# Altium schematic sheet ej_2.SchDoc
size A4
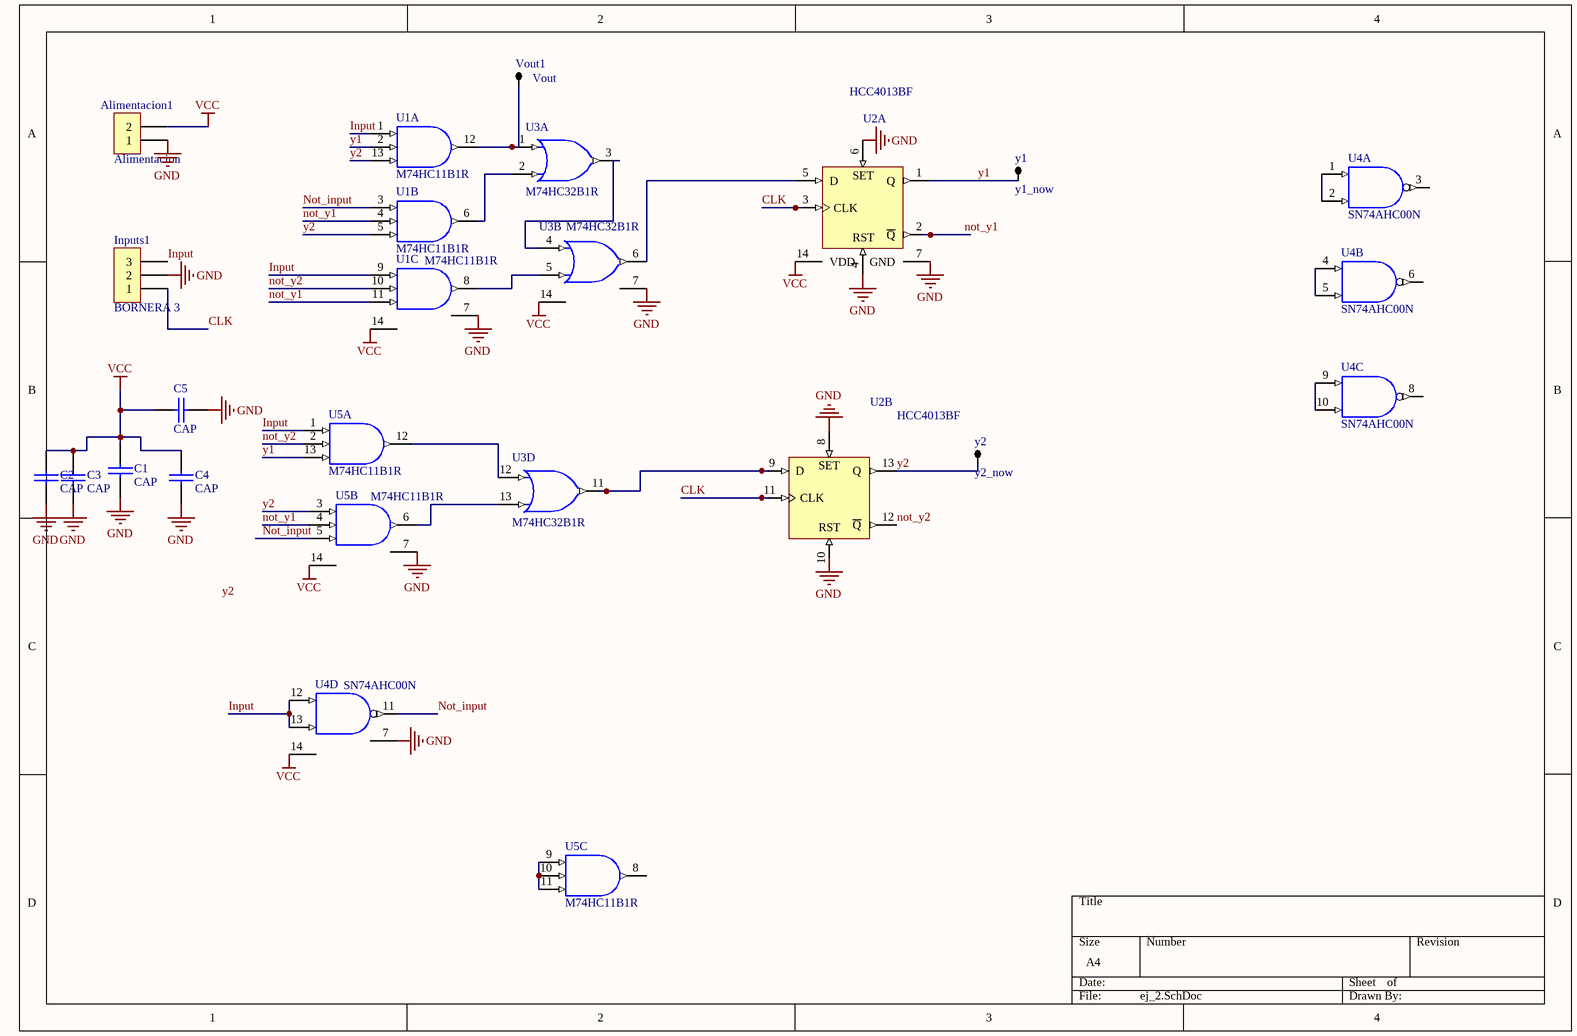
[diagram p0: ej_2.SchDoc]

## Parts
Alimentacion1  Alimentacion  [BORNERA2]
C1  CAP  [CAP200]
C2  CAP  [CAP200]
C3  CAP  [CAP200]
C4  CAP  [CAP200]
C5  CAP  [CAP200]
Inputs1  BORNERA 3  [BORNERA3]
U1  M74HC11B1R  [DIP14]  (parts A,B,C of 3)
U2  HCC4013BF  [CDIP14]  (parts A,B of 2)
U3  M74HC32B1R  [DIP14]  (parts A,B,D of 4)
U4  SN74AHC00N  [N014]  (parts A,B,C,D of 4)
U5  M74HC11B1R  [DIP14]  (parts A,B,C of 3)
Vout1  Vout  [TPTH]
y1  y1_now  [TPTH]
y2  y2_now  [TPTH]

## Nets
GND: Alimentacion1.1 C1.2 C2.2 C3.2 C4.2 C5.2 Inputs1.2 U1.7(GND) U2.4(RST) U2.6(S) U2.7(GND) U2.8(S) U3.7(GND) U4.7(GND) U5.7(GND)
VCC: Alimentacion1.2 C1.1 C2.1 C3.1 C4.1 C5.1 U1.14(VCC) U2.14(VDD) U3.14(VCC) U4.14(VCC) U5.14(VCC)  [also labelled VDD]
CLK: Inputs1.1 U2.3(CLK) U2.11(CLK)
Input: Inputs1.3 U1.1(A) U1.9(A) U4.12(A) U4.13(B) U5.1(A)
Not_input: U1.3(A) U4.11(Y) U5.5(C)
not_y1: U1.4(B) U1.11(C) U2.2(~{Q}) U5.4(B)
not_y2: U1.10(B) U2.12(~{Q}) U5.2(B)
y1: U1.2(B) U2.1(Q) U5.13(C) y1.1
y2: U1.5(C) U1.13(C) U2.13(Q) U5.3(A) y2.1
NetU1_6: U1.6(Y) U3.2(B)
NetU1_8: U1.8(Y) U3.5(B)
NetU1_12: U1.12(Y) U3.1(A) Vout1.1
NetU2_5: U2.5(D) U3.6(Y)
NetU2_9: U2.9(D) U3.11(Y)
NetU3_3: U3.3(Y) U3.4(A)
NetU3_12: U3.12(A) U5.12(Y)
NetU3_13: U3.13(B) U5.6(Y)
NetU4_1: U4.1(A) U4.2(B)
NetU4_4: U4.4(A) U4.5(B)
NetU4_9: U4.9(A) U4.10(B)
NetU5_9: U5.9(A) U5.10(B) U5.11(C)

Not connected (* = marked no-connect by the designer): U2 10(RST); U4 3(Y) 6(Y) 8(Y); U5 8(Y)

## Notes on the sheet
- Labels drawn without touching a wire or pin: GND, y2
- (in symbol HCC4013BF, part A) SET
- (in symbol HCC4013BF, part B) SET

## Library data of the parts
Alimentacion1 = BORNERA 2
U1 U5 = M74HC11B1R: Triple 3-Input AND Gate; Published: 8-Jun-2000; LatestRevisionDate: 06-Jun-2005; LatestRevisionNote: Stylized 3D Model Added.; DatasheetVersion: Feb-1993; PackageVersion: Jan-1997; PackageReference: DIP14; Publisher: Altium Limited; PackageDescription: DIP; 14 Leads; Row Spacing 7.62 mm; Pitch 2.54 mm; ComponentLink1Description: Manufacturer Link; ComponentLink1URL: http://www.st.com/; ComponentLink2Description: Datasheet; ComponentLink2URL: http://www.st.com/stonline/products/literature/ds/1890/m74hc11.pdf
U2 = HCC4013BF: Dual D-Type Flip-Flop; Published: 8-Jun-2000; LatestRevisionDate: 06-Jun-2005; LatestRevisionNote: Stylized 3D Model Added.; DatasheetVersion: Jun-1989; PackageReference: CDIP14; Publisher: Altium Limited; PackageDescription: DIP; 14 Leads; Row Spacing 7.62 mm; Pitch 2.54 mm; ComponentLink1Description: Manufacturer Link; ComponentLink1URL: http://www.st.com/
U3 = M74HC32B1R: Quad 2-Input OR Gate; Published: 8-Jun-2000; LatestRevisionDate: 06-Jun-2005; LatestRevisionNote: Stylized 3D Model Added.; DatasheetVersion: Dec-1992; PackageVersion: Jan-1997; PackageReference: DIP14; Publisher: Altium Limited; PackageDescription: DIP; 14 Leads; Row Spacing 7.62 mm; Pitch 2.54 mm; ComponentLink1Description: Manufacturer Link; ComponentLink1URL: http://www.st.com/; ComponentLink2Description: Datasheet; ComponentLink2URL: http://www.st.com/stonline/products/literature/ds/1944/m74hc32.pdf
U4 = SN74AHC00N: Quadruple 2-Input Positive-NAND Gate; Published: 8-Jun-2000; LatestRevisionDate: 04-Mar-2005; LatestRevisionNote: Stylized 3D Model Added.; DatasheetVersion: Jun-1998; PackageVersion: Oct-1995; PackageReference: N014; Publisher: Altium Limited; PackageDescription: DIP; 14 Leads; Row Spacing 7.62 mm; Pitch 2.54 mm; ComponentLink1Description: Manufacturer Link; ComponentLink1URL: http://www.ti.com/; ComponentLink2Description: Datasheet; ComponentLink2URL: http://www-s.ti.com/sc/ds/sn74ahc00.pdf; ComponentLink3Description: Packaging Specification; ComponentLink3URL: http://focus.ti.com/lit/ml/mpdi002c/mpdi002c.pdf
Vout1 y1 y2 = TP